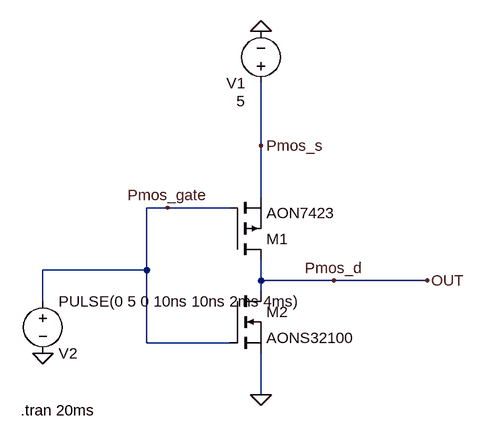
[diagram p0: schematic Not_improved.asc]
Not_improved.asc, the LTspice schematic file:
Version 4
SHEET 1 880 680
WIRE 304 48 304 -48
WIRE 304 128 304 48
WIRE 160 144 128 144
WIRE 256 144 160 144
WIRE 128 240 128 144
WIRE 128 240 -32 240
WIRE 304 256 304 224
WIRE 416 256 304 256
WIRE 560 256 416 256
WIRE 304 272 304 256
WIRE -32 288 -32 240
WIRE 128 352 128 240
WIRE 256 352 128 352
WIRE 304 432 304 368
FLAG -32 368 0
FLAG 560 256 OUT
FLAG 304 432 0
FLAG 304 -128 0
FLAG 160 144 Pmos_gate
FLAG 304 48 Pmos_s
FLAG 416 256 Pmos_d
DATAFLAG -32 256 ""
SYMBOL voltage 304 -32 R180
WINDOW 3 24 -12 Left 2
WINDOW 123 0 0 Left 0
WINDOW 39 0 0 Left 0
SYMATTR InstName V1
SYMATTR Value 5
SYMBOL voltage -32 272 R0
WINDOW 0 24 96 Left 2
WINDOW 3 24 16 Left 2
WINDOW 123 0 0 Left 0
WINDOW 39 0 0 Left 0
SYMATTR InstName V2
SYMATTR Value PULSE(0 5 0 10ns 10ns 2ms 4ms)
SYMBOL nmos 256 272 R0
SYMATTR InstName M2
SYMATTR Value AONS32100
SYMBOL pmos 256 224 M180
SYMATTR InstName M1
SYMATTR Value AON7423
TEXT -66 456 Left 2 !.tran 20ms

The netlist it stands for:
* Not_improved.asc
V1 Pmos_s 0 5
V2 Pmos_gate 0 PULSE(0 5 0 10ns 10ns 2ms 4ms)
M2 Pmos_d Pmos_gate 0 0 AONS32100
M1 Pmos_d Pmos_gate Pmos_s Pmos_s AON7423
.model NMOS NMOS
.model PMOS PMOS
.lib standard.mos
.tran 20ms
.backanno
.end